# Altium schematic sheet StressMonitor.SchDoc
size A3
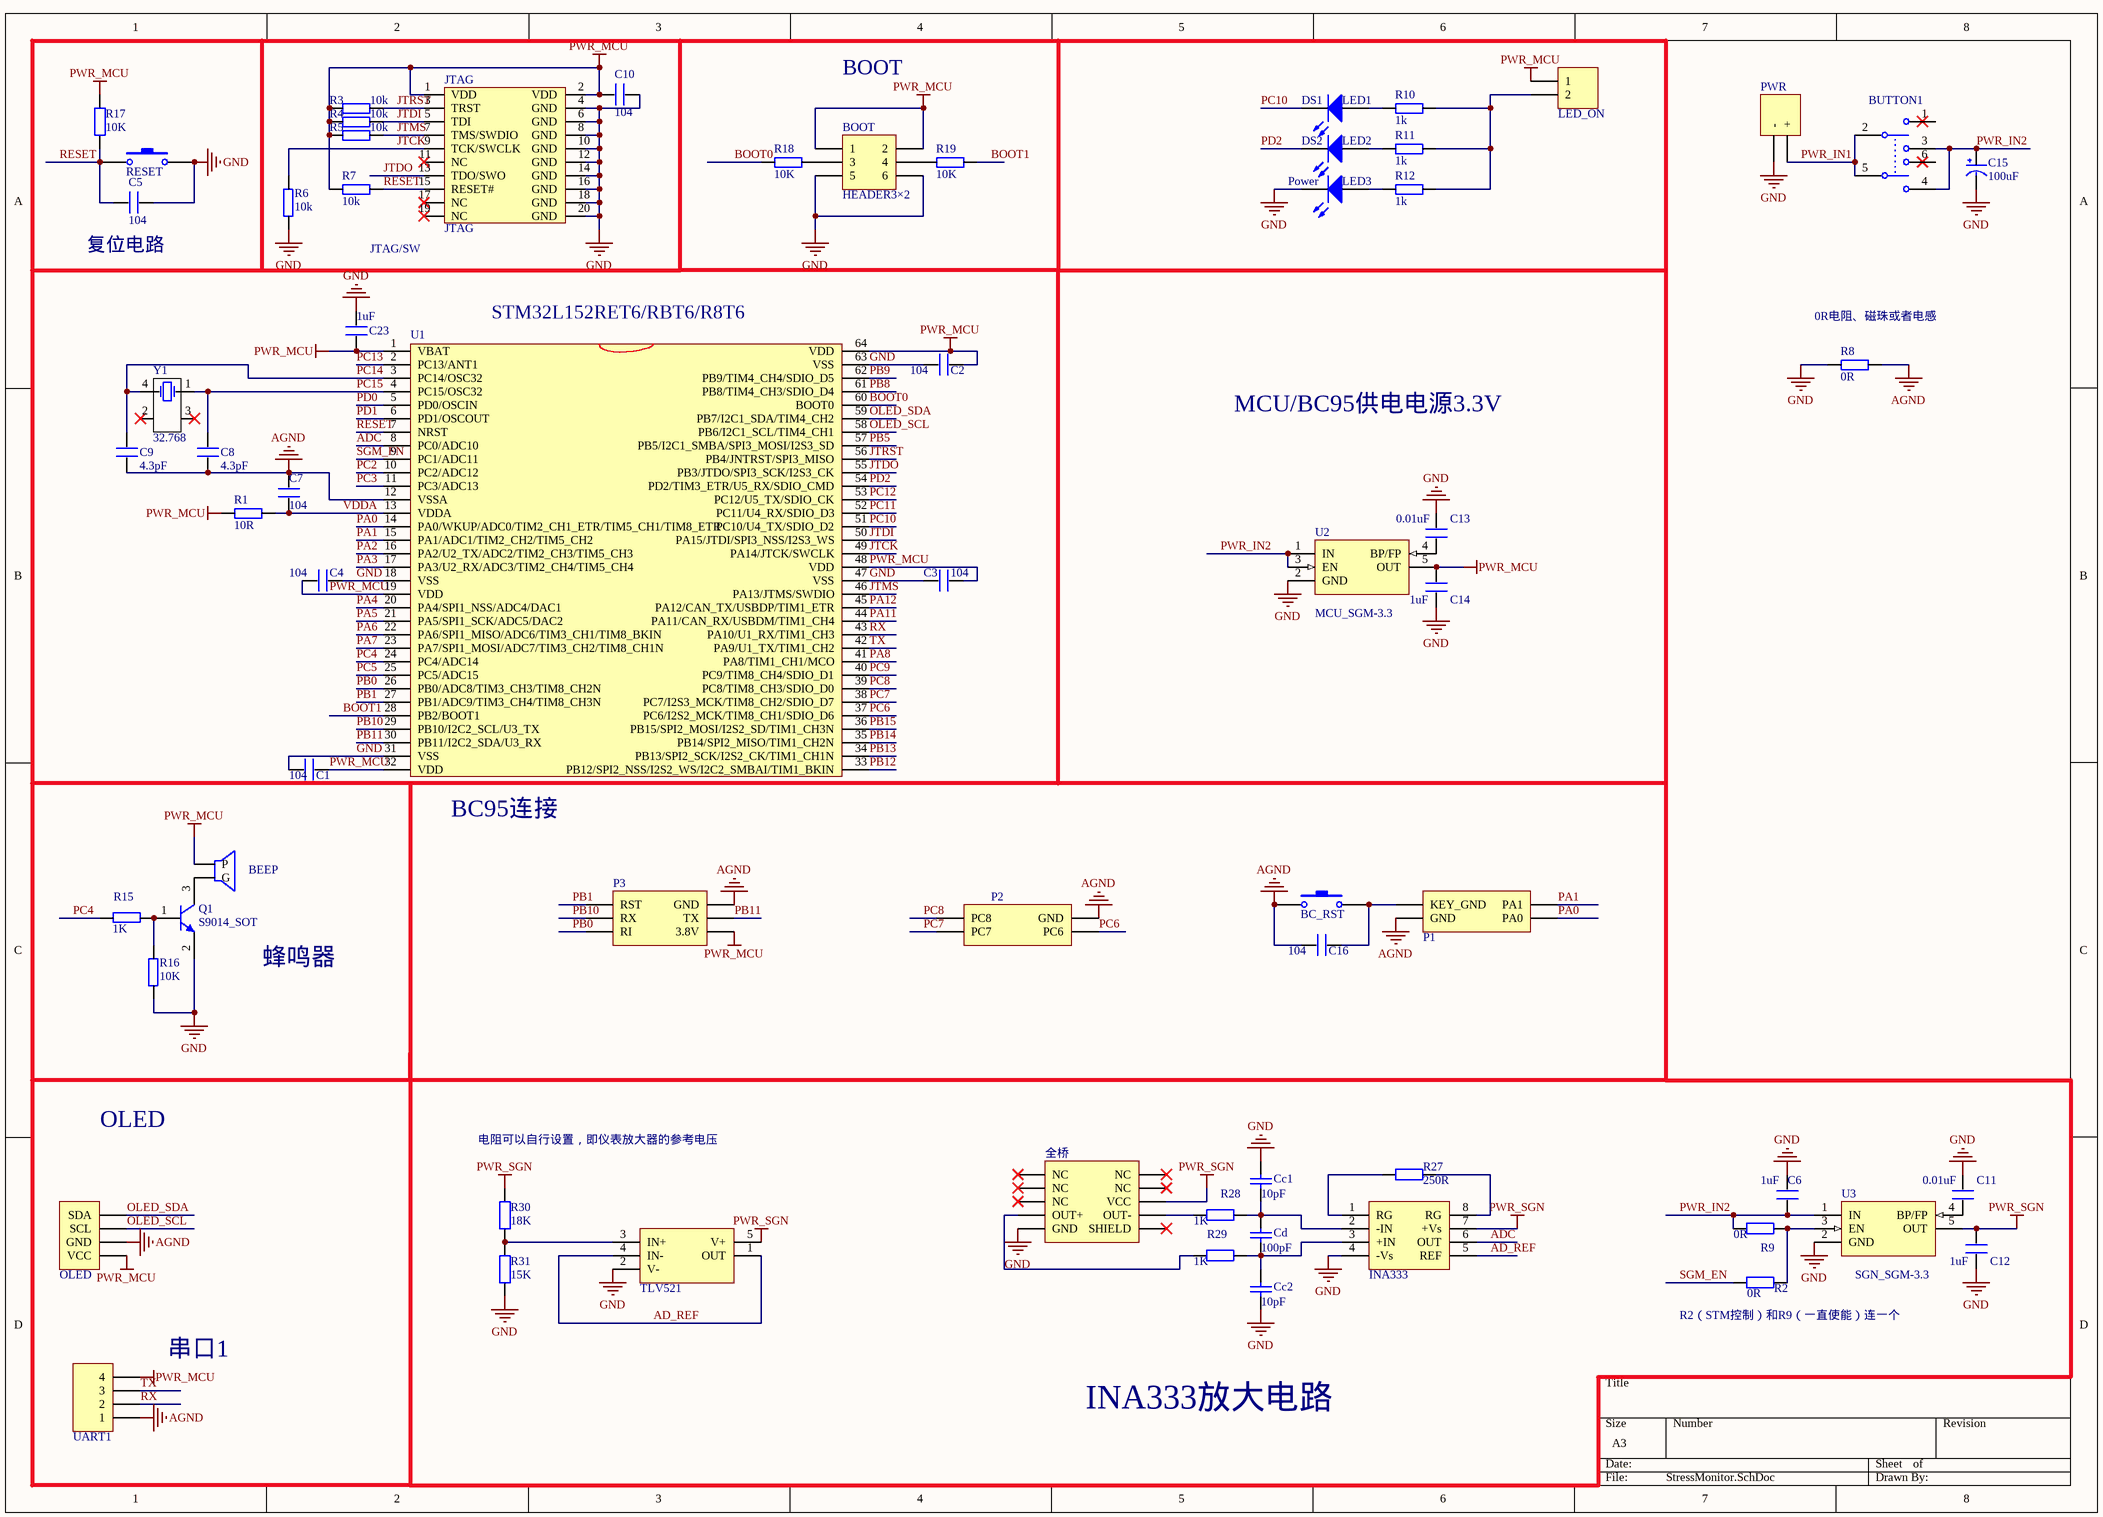
[diagram p0: StressMonitor.SchDoc]

## Parts
BC_RST  SW-PB  [SW_PB2_A2]  (value not drawn)
BEEP  BEEP  [Beep]
BOOT  HEADER3×2  [HDR2X3]
BUTTON1  SW-DPDT1  [SWITCH_B2]  (value not drawn)
C1  104  [C-RAD-0603]
C2  104  [C-RAD-0603]
C3  104  [C-RAD-0603]
C4  104  [C-RAD-0603]
C5  104  [C-RAD-0603]
C6  1uF  [C-RAD-0603]
C7  104  [C-RAD-0603]
C8  4.3pF  [C-RAD-0603]
C9  4.3pF  [C-RAD-0603]
C10  104  [C-RAD-0603]
C11  0.01uF  [C-RAD-0603]
C12  1uF  [C-RAD-0603]
C13  0.01uF  [C-RAD-0603]
C14  1uF  [C-RAD-0603]
C15  100uF  [C-RB-S6]
C16  104  [C-RAD-0603]
C23  1uF  [C-RAD-0603]
Cc1  value 10pF  [C-RAD-0603]  (hidden comment: Cap)
Cc2  value 10pF  [C-RAD-0603]  (hidden comment: Cap)
Cd  value 100pF  [C-RAD-0603]  (hidden comment: Cap)
DS1  LED1  [SMDLED]
DS2  LED2  [SMDLED]
INA333  AD620  [MSOP-MS8_M]  (value not drawn)
JTAG  JTAG  [JTAG_20]
LED_ON  Header 2  [HDR2X1_A]  (value not drawn)
OLED  OLED  [HDR4X1_A]  (value not drawn)
P1  BC95_P1  [HDR2X2_A]  (value not drawn)
P2  BC95_P2  [HDR2X2_A]  (value not drawn)
P3  BC95_P3  [HDR3X2]  (value not drawn)
Power  LED3  [SMDLED]
PWR  Header 2  [HDR2X1_A]  (value not drawn)
Q1  S9014_SOT  [SOT-23]
R1  10R  [0805-1]
R2  NC: 0R  [0805-1]  (hidden comment: Res1)
R3  10k  [0805-1]
R4  10k  [0805-1]
R5  10k  [0805-1]
R6  10k  [0805-1]
R7  10k  [0805-1]
R8  0R  [0805-1]
R9  NC: 0R  [0805-1]  (hidden comment: Res1)
R10  1k  [0805-1]
R11  1k  [0805-1]
R12  1k  [0805-1]
R15  1K  [0805-1]
R16  10K  [0805-1]
R17  10K  [0805-1]
R18  10K  [0805-1]
R19  10K  [0805-1]
R27  value 250R  [0805-1]  (hidden comment: 正式)
R28  value 1K  [0805-1]  (hidden comment: Res1)
R29  value 1K  [0805-1]  (hidden comment: Res1)
R30  value 18K  [0805-1]
R31  value 15K  [0805-1]
RESET  SW-PB  [SW_PB2_A2]  (value not drawn)
TLV521  TLV521  [DCK-5]  (value not drawn)
U1  STM32L152RET6/RBT6/R8T6  [LQFP-64]
U2  SGM2036  [SOT23-5]  (value not drawn)
U3  SGM2036  [SOT23-5]  (value not drawn)
UART1  Header 4  [HDR4X1_A]  (value not drawn)
Y1  value 32.768  [XTAL_8x3.8]  (hidden comment: XTAL_8x3.8)
全桥  连接全桥  [HDR5*2_2mm]  (value not drawn)

## Nets
AGND: BC_RST.1 C7.2 C8.1 C9.1 C16.1 OLED.2(GND) P1.2(GND) P2.4(GND) P3.6(GND) R8.2 U1.12(VSSA) UART1.1
GND: BOOT.5 BOOT.6 C1.1 C2.1 C3.1 C4.2 C5.2 C6.2 C10.2 C11.2 C12.1 C13.2 C14.1 C15.2(GND) C23.1 Cc1.2 Cc2.1 INA333.4(-Vs) JTAG.4(GND) JTAG.6(GND) JTAG.8(GND) JTAG.10(GND) JTAG.12(GND) JTAG.14(GND) JTAG.16(GND) JTAG.18(GND) JTAG.20(GND) Power.2(K) PWR.1(-) Q1.2(E) R6.2 R8.1 R16.2 R31.1 RESET.2 TLV521.2(V-) U1.18(VSS) U1.31(VSS) U1.47(VSS) U1.63(VSS) U2.2(GND) U3.2(GND) 全桥.9(GND)
PWR_MCU: BEEP.1(P) BOOT.1 BOOT.2 C1.2 C2.2 C3.2 C4.1 C10.1 C14.2 C23.2 JTAG.1(VDD) JTAG.2(VDD) LED_ON.1 OLED.1(VCC) P3.4(3.8V) R1.1 R3.1 R4.1 R5.1 R7.1 R17.2 U1.1(VBAT) U1.19(VDD) U1.32(VDD) U1.48(VDD) U1.64(VDD) U2.5(OUT) UART1.4
PWR_SGN: C12.2 INA333.7(+Vs) R30.2 TLV521.5(V+) U3.5(OUT) 全桥.6(VCC)
AD_REF: INA333.5(REF) TLV521.1(OUT) TLV521.4(IN-)
ADC: INA333.6(OUT) U1.8(PC0/ADC10)
BOOT0: R18.1 U1.60(BOOT0)
BOOT1: R19.2 U1.28(PB2/BOOT1)
JTCK: JTAG.9(TCK/SWCLK) R6.1 U1.49(PA14/JTCK/SWCLK)
JTDI: JTAG.5(TDI) R4.2 U1.50(PA15/JTDI/SPI3_NSS/I2S3_WS)
JTDO: JTAG.13(TDO/SWO) U1.55(PB3/JTDO/SPI3_SCK/I2S3_CK)
JTMS: JTAG.7(TMS/SWDIO) R5.2 U1.46(PA13/JTMS/SWDIO)
JTRST: JTAG.3(TRST) R3.2 U1.56(PB4/JNTRST/SPI3_MISO)
OLED_SCL: OLED.3(SCL) U1.58(PB6/I2C1_SCL/TIM4_CH1)
OLED_SDA: OLED.4(SDA) U1.59(PB7/I2C1_SDA/TIM4_CH2)
PA0: P1.3(PA0) U1.14(PA0/WKUP/ADC0/TIM2_CH1_ETR/TIM5_CH1/TIM8_ETR)
PA1: P1.4(PA1) U1.15(PA1/ADC1/TIM2_CH2/TIM5_CH2)
PA2: U1.16(PA2/U2_TX/ADC2/TIM2_CH3/TIM5_CH3)
PA3: U1.17(PA3/U2_RX/ADC3/TIM2_CH4/TIM5_CH4)
PA4: U1.20(PA4/SPI1_NSS/ADC4/DAC1)
PA5: U1.21(PA5/SPI1_SCK/ADC5/DAC2)
PA6: U1.22(PA6/SPI1_MISO/ADC6/TIM3_CH1/TIM8_BKIN)
PA7: U1.23(PA7/SPI1_MOSI/ADC7/TIM3_CH2/TIM8_CH1N)
PA8: U1.41(PA8/TIM1_CH1/MCO)
PA11: U1.44(PA11/CAN_RX/USBDM/TIM1_CH4)
PA12: U1.45(PA12/CAN_TX/USBDP/TIM1_ETR)
PB0: P3.3(RI) U1.26(PB0/ADC8/TIM3_CH3/TIM8_CH2N)
PB1: P3.1(RST) U1.27(PB1/ADC9/TIM3_CH4/TIM8_CH3N)
PB5: U1.57(PB5/I2C1_SMBA/SPI3_MOSI/I2S3_SD)
PB8: U1.61(PB8/TIM4_CH3/SDIO_D4)
PB9: U1.62(PB9/TIM4_CH4/SDIO_D5)
PB10: P3.2(RX) U1.29(PB10/I2C2_SCL/U3_TX)
PB11: P3.5(TX) U1.30(PB11/I2C2_SDA/U3_RX)
PB12: U1.33(PB12/SPI2_NSS/I2S2_WS/I2C2_SMBAI/TIM1_BKIN)
PB13: U1.34(PB13/SPI2_SCK/I2S2_CK/TIM1_CH1N)
PB14: U1.35(PB14/SPI2_MISO/TIM1_CH2N)
PB15: U1.36(PB15/SPI2_MOSI/I2S2_SD/TIM1_CH3N)
PC2: U1.10(PC2/ADC12)
PC3: U1.11(PC3/ADC13)
PC4: R15.2 U1.24(PC4/ADC14)
PC5: U1.25(PC5/ADC15)
PC6: P2.3(PC6) U1.37(PC6/I2S2_MCK/TIM8_CH1/SDIO_D6)
PC7: P2.2(PC7) U1.38(PC7/I2S3_MCK/TIM8_CH2/SDIO_D7)
PC8: P2.1(PC8) U1.39(PC8/TIM8_CH3/SDIO_D0)
PC9: U1.40(PC9/TIM8_CH4/SDIO_D1)
PC10: DS1.2(K) U1.51(PC10/U4_TX/SDIO_D2)
PC11: U1.52(PC11/U4_RX/SDIO_D3)
PC12: U1.53(PC12/U5_TX/SDIO_CK)
PC13: U1.2(PC13/ANT1)
PC14: C9.2 U1.3(PC14/OSC32) Y1.4(OSC1)
PC15: C8.2 U1.4(PC15/OSC32) Y1.1(OSC2)
PD0: U1.5(PD0/OSCIN)
PD1: U1.6(PD1/OSCOUT)
PD2: DS2.2(K) U1.54(PD2/TIM3_ETR/U5_RX/SDIO_CMD)
PWR_IN1: BUTTON1.2 BUTTON1.5 PWR.2(+)
PWR_IN2: BUTTON1.3 BUTTON1.4 C6.1 C15.1(VCC) R9.2 U2.1(IN) U2.3(EN) U3.1(IN)
RESET: C5.1 JTAG.15(RESET#) R7.2 R17.1 RESET.1 U1.7(NRST)
RX: U1.43(PA10/U1_RX/TIM1_CH3) UART1.2
SGM_EN: R2.1 U1.9(PC1/ADC11)
TX: U1.42(PA9/U1_TX/TIM1_CH2) UART1.3
VDDA: C7.1 R1.2 U1.13(VDDA)
NetBC_RST_2: BC_RST.2 C16.2 P1.1(KEY_GND)
NetBEEP_2: BEEP.2(G) Q1.3(C)
NetBOOT_3: BOOT.3 R18.2
NetBOOT_4: BOOT.4 R19.1
NetC11_1: C11.1 U3.4(BP/FP)
NetC13_1: C13.1 U2.4(BP/FP)
NetCc1_1: Cc1.1 Cd.2 INA333.2(-IN) R28.2
NetCc2_2: Cc2.2 Cd.1 INA333.3(+IN) R29.2
NetDS1_1: DS1.1(A) R10.1
NetDS2_1: DS2.1(A) R11.1
NetINA333_1: INA333.1(RG) R27.1
NetINA333_8: INA333.8(RG) R27.2
NetLED_ON_2: LED_ON.2 R10.2 R11.2 R12.2
NetPower_1: Power.1(A) R12.1
NetQ1_1: Q1.1(B) R15.1 R16.1
NetR2_2: R2.2 R9.1 U3.3(EN)
NetR28_1: R28.1 全桥.8(OUT-)
NetR29_1: R29.1 全桥.7(OUT+)
NetR30_1: R30.1 R31.2 TLV521.3(IN+)

Not connected (* = marked no-connect by the designer): BUTTON1 1 6; JTAG 11(NC)* 17(NC)* 19(NC)*; Y1 2(NC)* 3(NC)*; 全桥 1(NC)* 2(NC)* 3(NC)* 4(NC)* 5(NC)* 10(SHIELD)*

## Notes on the sheet
- BOOT
- (near C5) 复位电路
- JTAG/SW
- (near R8) 0R电阻、磁珠或者电感
- MCU/BC95供电电源3.3V
- (near U2) MCU_SGM-3.3
- (near U1) BC95连接
- 蜂鸣器
- OLED
- 电阻可以自行设置，即仪表放大器的参考电压
- (near R2) R2（STM控制）和R9（一直使能）连一个
- (near U3) SGN_SGM-3.3
- 串口1
- INA333放大电路

## Library data of the parts
BC_RST RESET = SW-PB: 微动开关; Published: 24-Mar-1999; LatestRevisionDate: 17-Jul-2002; LatestRevisionNote: Re-released for DXP Platform.; PackageReference: SPST-2; Publisher: Altium Limited
BOOT = Header 3X2: Header, 3-Pin, Dual row; LatestRevisionDate: 17-Jul-2002; LatestRevisionNote: Re-released for DXP Platform.; Publisher: Altium Limited
BUTTON1 = SW-DPDT: 单刀双掷开关; Published: 24-Mar-1999; LatestRevisionDate: 17-Jul-2002; LatestRevisionNote: Re-released for DXP Platform.; PackageReference: DPDT-6; Publisher: Altium Limited
C1-C14 C16 C23 = C
C15 = CAP
Cc1 Cc2 Cd = Cap: 无极性电容; Published: 8-Jun-2000; LatestRevisionDate: 17-Jul-2002; LatestRevisionNote: Re-released for DXP Platform.; PackageReference: RAD-0.3; Publisher: Altium Limited
DS1 DS2 Power = LED2: Typical RED, GREEN, YELLOW, AMBER GaAs LED; Published: 8-Jun-2000; LatestRevisionDate: 17-Jul-2002; LatestRevisionNote: Re-released for DXP Platform.; PackageDocument: Feb-2002; PackageReference: 3.2X1.6X1.1; Publisher: Altium Limited
INA333 = AD620: 仪用放大器; Published: 8-Jun-2000; LatestRevisionDate: 17-Jul-2002; LatestRevisionNote: Re-released for DXP Platform.; PackageReference: RAD-0.3; Publisher: Altium Limited
LED_ON PWR = Header 2: 接插件; LatestRevisionDate: 17-Jul-2002; LatestRevisionNote: Re-released for DXP Platform.; Publisher: Altium Limited
P1 = BC95_P1: 连接BC的GND等四个脚; LatestRevisionDate: 17-Jul-2002; LatestRevisionNote: Re-released for DXP Platform.; Publisher: Altium Limited
P2 = BC95_P2: 连接BC的GND等四个脚; LatestRevisionDate: 17-Jul-2002; LatestRevisionNote: Re-released for DXP Platform.; Publisher: Altium Limited
P3 = BC95_P3: BC95的通信部分; LatestRevisionDate: 17-Jul-2002; LatestRevisionNote: Re-released for DXP Platform.; Publisher: Altium Limited
Q1 = S9014_SOT: NPN三极管; Published: 8-Jun-2000; LatestRevisionDate: 15-Jan-2003; LatestRevisionNote: PCB Footprint 'BCY-W3/D4.7' replaced; DatasheetDocument: 1997; PackageDocument: Sep-1998; PackageReference: TO-92A; Publisher: Altium Limited; Code_JEDEC: TO-92A; ComponentLink1Description: Manufacturer Link; ComponentLink1URL: http://www.fairchildsemi.com/; ComponentLink2Description: Datasheet; ComponentLink2URL: http://www.fairchildsemi.com/ds/2N%2F2N3904.pdf
R1 R3-R8 R10-R12 R15 R16 R18 R19 = R
R2 R9 R17 R27-R31 = Res1: 贴片电阻; Published: 8-Jun-2000; LatestRevisionDate: 17-Jul-2002; LatestRevisionNote: Re-released for DXP Platform.; PackageReference: AXIAL-0.4; Publisher: Altium Limited
  R17: Value: 10K
TLV521 = TLV521: 低功耗稳压; Published: 8-Jun-2000; LatestRevisionDate: 17-Jul-2002; LatestRevisionNote: Re-released for DXP Platform.; PackageReference: RAD-0.3; Publisher: Altium Limited
U1 = STM32F103RDT6
U2 U3 = SGM2036: 低功耗稳压; Published: 8-Jun-2000; LatestRevisionDate: 17-Jul-2002; LatestRevisionNote: Re-released for DXP Platform.; PackageReference: RAD-0.3; Publisher: Altium Limited
UART1 = Header 4: 接插件; LatestRevisionDate: 17-Jul-2002; LatestRevisionNote: Re-released for DXP Platform.; Publisher: Altium Limited
Y1 = XTAL_8x3.8: 贴片晶振
全桥 = StrainGage: 全桥应变片插口;从TB购买; LatestRevisionDate: 17-Jul-2002; LatestRevisionNote: Re-released for DXP Platform.; Publisher: Altium Limited
OLED = OLED: LatestRevisionDate: 17-Jul-2002; LatestRevisionNote: Re-released for DXP Platform.; Publisher: Altium Limited